# EAGLE design lotokey (EAGLE 9.6.2)
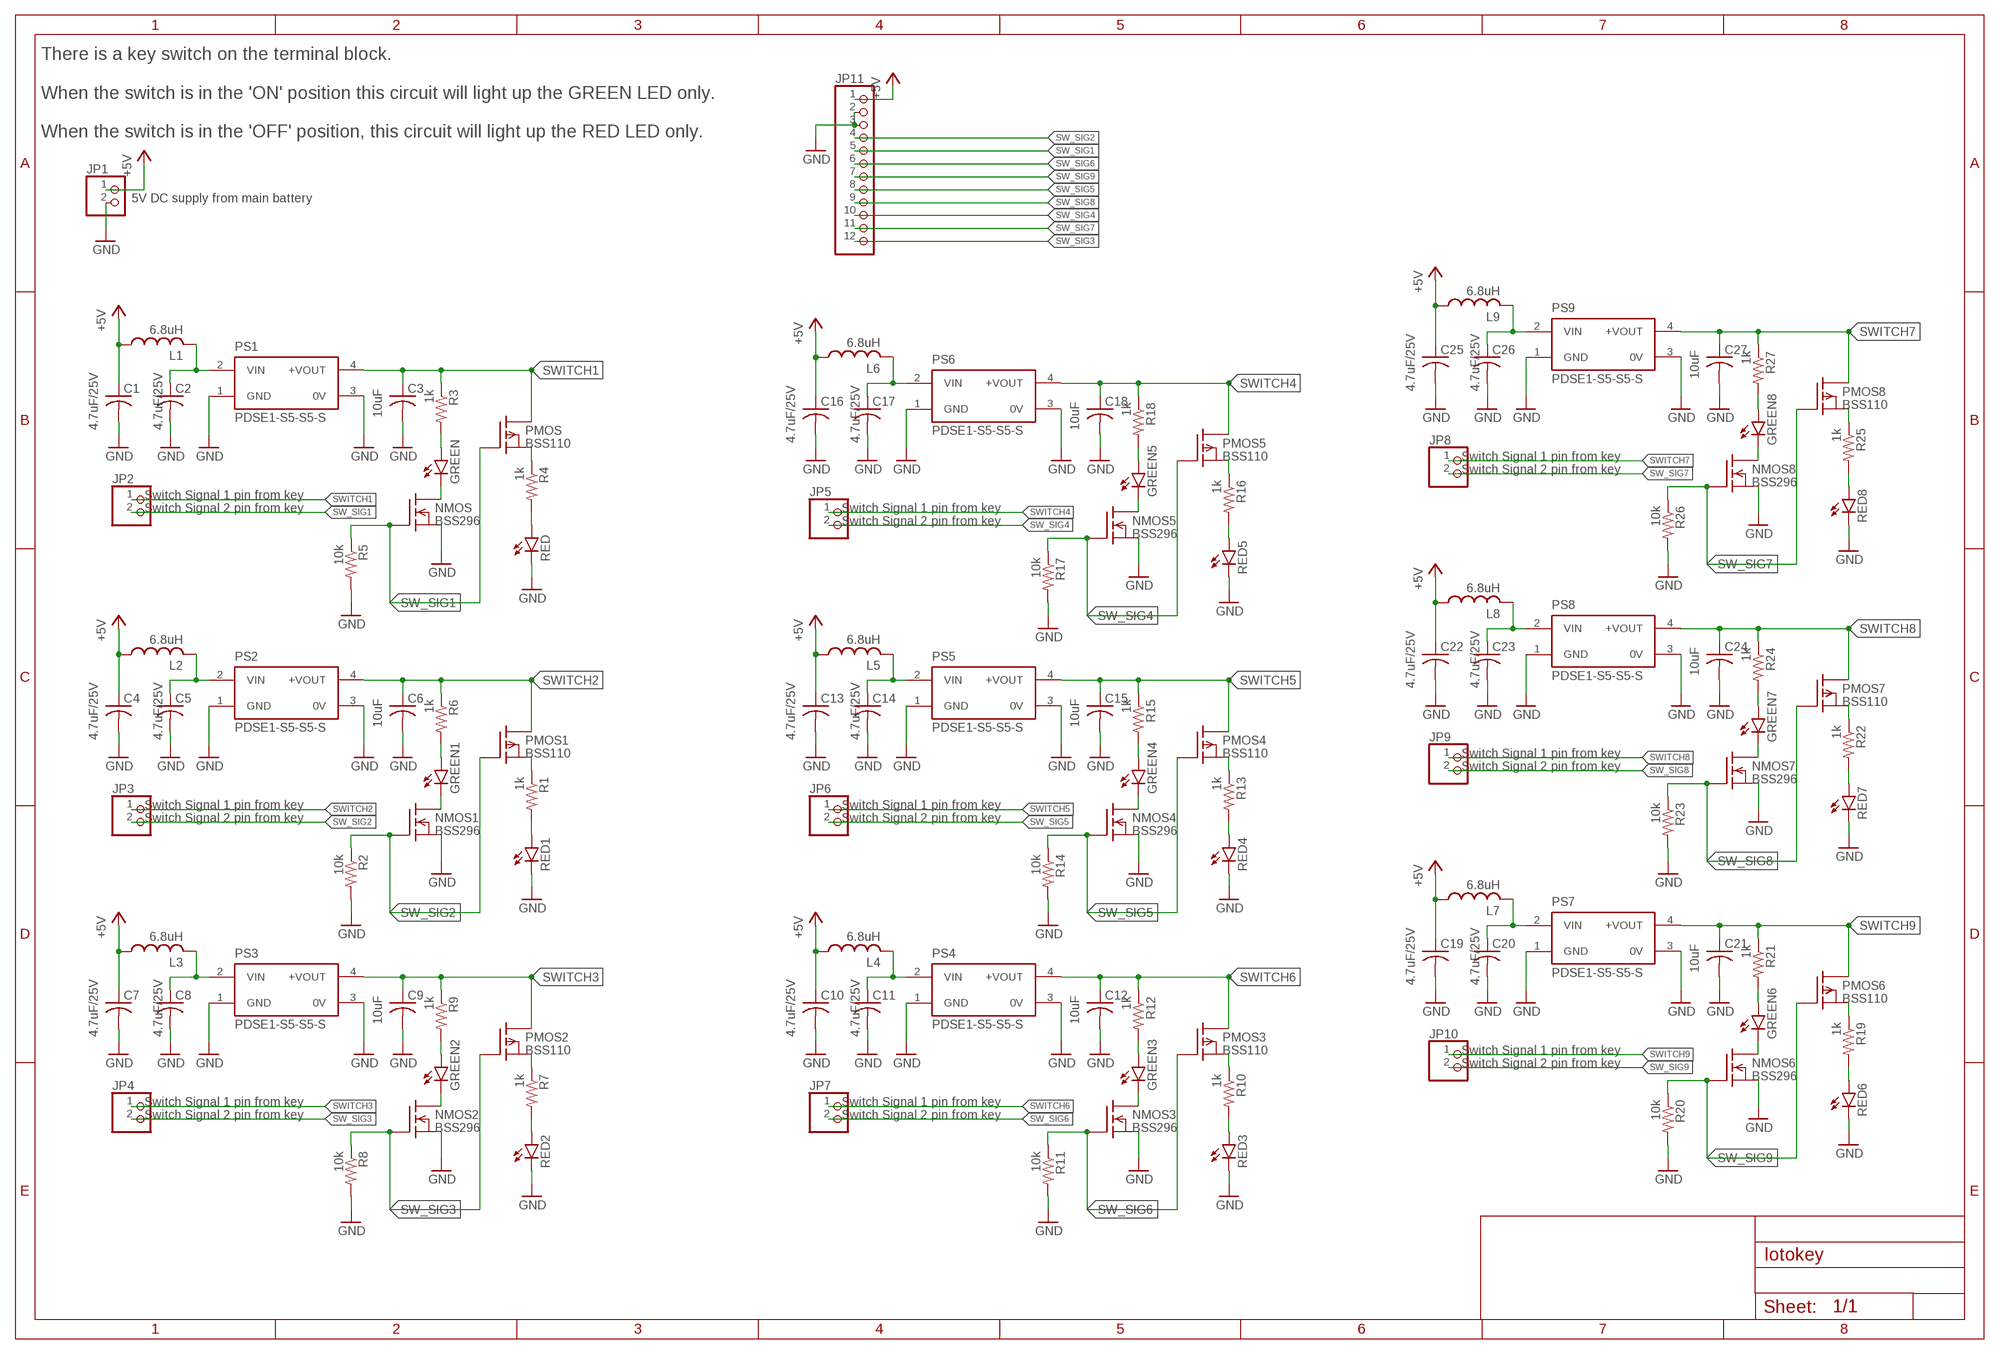
[diagram p0: schematic, sheet 1]

## Parts
C1  4.7uF/25V  C-US050-025X075  [C050-025X075]
C2  4.7uF/25V  C-US050-025X075  [C050-025X075]
C3  10uF  C-US050-025X075  [C050-025X075]
C4  4.7uF/25V  C-US050-025X075  [C050-025X075]
C5  4.7uF/25V  C-US050-025X075  [C050-025X075]
C6  10uF  C-US050-025X075  [C050-025X075]
C7  4.7uF/25V  C-US050-025X075  [C050-025X075]
C8  4.7uF/25V  C-US050-025X075  [C050-025X075]
C9  10uF  C-US050-025X075  [C050-025X075]
C10  4.7uF/25V  C-US050-025X075  [C050-025X075]
C11  4.7uF/25V  C-US050-025X075  [C050-025X075]
C12  10uF  C-US050-025X075  [C050-025X075]
C13  4.7uF/25V  C-US050-025X075  [C050-025X075]
C14  4.7uF/25V  C-US050-025X075  [C050-025X075]
C15  10uF  C-US050-025X075  [C050-025X075]
C16  4.7uF/25V  C-US050-025X075  [C050-025X075]
C17  4.7uF/25V  C-US050-025X075  [C050-025X075]
C18  10uF  C-US050-025X075  [C050-025X075]
C19  4.7uF/25V  C-US050-025X075  [C050-025X075]
C20  4.7uF/25V  C-US050-025X075  [C050-025X075]
C21  10uF  C-US050-025X075  [C050-025X075]
C22  4.7uF/25V  C-US050-025X075  [C050-025X075]
C23  4.7uF/25V  C-US050-025X075  [C050-025X075]
C24  10uF  C-US050-025X075  [C050-025X075]
C25  4.7uF/25V  C-US050-025X075  [C050-025X075]
C26  4.7uF/25V  C-US050-025X075  [C050-025X075]
C27  10uF  C-US050-025X075  [C050-025X075]
GREEN  TLLR4400  [LED3MM]
GREEN1  TLLR4400  [LED3MM]
GREEN2  TLLR4400  [LED3MM]
GREEN3  TLLR4400  [LED3MM]
GREEN4  TLLR4400  [LED3MM]
GREEN5  TLLR4400  [LED3MM]
GREEN6  TLLR4400  [LED3MM]
GREEN7  TLLR4400  [LED3MM]
GREEN8  TLLR4400  [LED3MM]
JP1  PINHD-1X2  [1X02]
JP2  PINHD-1X2  [1X02]
JP3  PINHD-1X2  [1X02]
JP4  PINHD-1X2  [1X02]
JP5  PINHD-1X2  [1X02]
JP6  PINHD-1X2  [1X02]
JP7  PINHD-1X2  [1X02]
JP8  PINHD-1X2  [1X02]
JP9  PINHD-1X2  [1X02]
JP10  PINHD-1X2  [1X02]
JP11  PINHD-1X12  [1X12]
L1  6.8uH  L-US0204/5  [0204/5]
L2  6.8uH  L-US0204/5  [0204/5]
L3  6.8uH  L-US0204/5  [0204/5]
L4  6.8uH  L-US0204/5  [0204/5]
L5  6.8uH  L-US0204/5  [0204/5]
L6  6.8uH  L-US0204/5  [0204/5]
L7  6.8uH  L-US0204/5  [0204/5]
L8  6.8uH  L-US0204/5  [0204/5]
L9  6.8uH  L-US0204/5  [0204/5]
NMOS  BSS296  [TO92]
NMOS1  BSS296  [TO92]
NMOS2  BSS296  [TO92]
NMOS3  BSS296  [TO92]
NMOS4  BSS296  [TO92]
NMOS5  BSS296  [TO92]
NMOS6  BSS296  [TO92]
NMOS7  BSS296  [TO92]
NMOS8  BSS296  [TO92]
PMOS  BSS110  [TO92]
PMOS1  BSS110  [TO92]
PMOS2  BSS110  [TO92]
PMOS3  BSS110  [TO92]
PMOS4  BSS110  [TO92]
PMOS5  BSS110  [TO92]
PMOS6  BSS110  [TO92]
PMOS7  BSS110  [TO92]
PMOS8  BSS110  [TO92]
PS1  PDSE1-S5-S5-S  [CONV_PDSE1-S5-S5-S]
PS2  PDSE1-S5-S5-S  [CONV_PDSE1-S5-S5-S]
PS3  PDSE1-S5-S5-S  [CONV_PDSE1-S5-S5-S]
PS4  PDSE1-S5-S5-S  [CONV_PDSE1-S5-S5-S]
PS5  PDSE1-S5-S5-S  [CONV_PDSE1-S5-S5-S]
PS6  PDSE1-S5-S5-S  [CONV_PDSE1-S5-S5-S]
PS7  PDSE1-S5-S5-S  [CONV_PDSE1-S5-S5-S]
PS8  PDSE1-S5-S5-S  [CONV_PDSE1-S5-S5-S]
PS9  PDSE1-S5-S5-S  [CONV_PDSE1-S5-S5-S]
R1  1k  R-US_0204/7  [0204/7]
R2  10k  R-US_0204/7  [0204/7]
R3  1k  R-US_0204/7  [0204/7]
R4  1k  R-US_0204/7  [0204/7]
R5  10k  R-US_0204/7  [0204/7]
R6  1k  R-US_0204/7  [0204/7]
R7  1k  R-US_0204/7  [0204/7]
R8  10k  R-US_0204/7  [0204/7]
R9  1k  R-US_0204/7  [0204/7]
R10  1k  R-US_0204/7  [0204/7]
R11  10k  R-US_0204/7  [0204/7]
R12  1k  R-US_0204/7  [0204/7]
R13  1k  R-US_0204/7  [0204/7]
R14  10k  R-US_0204/7  [0204/7]
R15  1k  R-US_0204/7  [0204/7]
R16  1k  R-US_0204/7  [0204/7]
R17  10k  R-US_0204/7  [0204/7]
R18  1k  R-US_0204/7  [0204/7]
R19  1k  R-US_0204/7  [0204/7]
R20  10k  R-US_0204/7  [0204/7]
R21  1k  R-US_0204/7  [0204/7]
R22  1k  R-US_0204/7  [0204/7]
R23  10k  R-US_0204/7  [0204/7]
R24  1k  R-US_0204/7  [0204/7]
R25  1k  R-US_0204/7  [0204/7]
R26  10k  R-US_0204/7  [0204/7]
R27  1k  R-US_0204/7  [0204/7]
RED  TLLR4400  [LED3MM]
RED1  TLLR4400  [LED3MM]
RED2  TLLR4400  [LED3MM]
RED3  TLLR4400  [LED3MM]
RED4  TLLR4400  [LED3MM]
RED5  TLLR4400  [LED3MM]
RED6  TLLR4400  [LED3MM]
RED7  TLLR4400  [LED3MM]
RED8  TLLR4400  [LED3MM]

## Nets
+5V: C1.1 C4.1 C7.1 C10.1 C13.1 C16.1 C19.1 C22.1 C25.1 JP1.1 JP11.1 L1.1 L2.1 L3.1 L4.1 L5.1 L6.1 L7.1 L8.1 L9.1
GND: C1.2 C2.2 C3.2 C4.2 C5.2 C6.2 C7.2 C8.2 C9.2 C10.2 C11.2 C12.2 C13.2 C14.2 C15.2 C16.2 C17.2 C18.2 C19.2 C20.2 C21.2 C22.2 C23.2 C24.2 C25.2 C26.2 C27.2 JP1.2 JP11.2 JP11.3 NMOS1.3(S) NMOS2.3(S) NMOS3.3(S) NMOS4.3(S) NMOS5.3(S) NMOS6.3(S) NMOS7.3(S) NMOS8.3(S) NMOS.3(S) PS1.1(GND) PS1.3(0V) PS2.1(GND) PS2.3(0V) PS3.1(GND) PS3.3(0V) PS4.1(GND) PS4.3(0V) PS5.1(GND) PS5.3(0V) PS6.1(GND) PS6.3(0V) PS7.1(GND) PS7.3(0V) PS8.1(GND) PS8.3(0V) PS9.1(GND) PS9.3(0V) R2.2 R5.2 R8.2 R11.2 R14.2 R17.2 R20.2 R23.2 R26.2 RED1.K(C) RED2.K(C) RED3.K(C) RED4.K(C) RED5.K(C) RED6.K(C) RED7.K(C) RED8.K(C) RED.K(C)
N$1: C2.1 L1.2 PS1.2(VIN)
N$2: R1.2 RED1.A
N$3: GREEN.K(C) NMOS.2(D)
N$4: GREEN.A R3.2
N$5: PMOS1.1(S) R1.1
N$6: C5.1 L2.2 PS2.2(VIN)
N$7: GREEN1.K(C) NMOS1.2(D)
N$8: R4.2 RED.A
N$9: PMOS.1(S) R4.1
N$10: GREEN1.A R6.2
N$11: R7.2 RED2.A
N$12: PMOS2.1(S) R7.1
N$13: C8.1 L3.2 PS3.2(VIN)
N$14: GREEN2.K(C) NMOS2.2(D)
N$15: GREEN2.A R9.2
N$16: R10.2 RED3.A
N$17: PMOS3.1(S) R10.1
N$18: C11.1 L4.2 PS4.2(VIN)
N$19: GREEN3.K(C) NMOS3.2(D)
N$20: GREEN3.A R12.2
N$21: R13.2 RED4.A
N$22: PMOS4.1(S) R13.1
N$23: C14.1 L5.2 PS5.2(VIN)
N$24: GREEN4.K(C) NMOS4.2(D)
N$25: GREEN4.A R15.2
N$26: R16.2 RED5.A
N$27: PMOS5.1(S) R16.1
N$28: C17.1 L6.2 PS6.2(VIN)
N$29: GREEN5.K(C) NMOS5.2(D)
N$30: GREEN5.A R18.2
N$31: R19.2 RED6.A
N$32: PMOS6.1(S) R19.1
N$33: C20.1 L7.2 PS7.2(VIN)
N$34: GREEN6.K(C) NMOS6.2(D)
N$35: GREEN6.A R21.2
N$36: R22.2 RED7.A
N$37: PMOS7.1(S) R22.1
N$38: C23.1 L8.2 PS8.2(VIN)
N$39: GREEN7.K(C) NMOS7.2(D)
N$40: GREEN7.A R24.2
N$41: R25.2 RED8.A
N$42: PMOS8.1(S) R25.1
N$43: C26.1 L9.2 PS9.2(VIN)
N$44: GREEN8.K(C) NMOS8.2(D)
N$45: GREEN8.A R27.2
SW_SIG1: JP2.2 JP11.5 NMOS.1(G) PMOS.2(G) R5.1
SW_SIG2: JP3.2 JP11.4 NMOS1.1(G) PMOS1.2(G) R2.1
SW_SIG3: JP4.2 JP11.12 NMOS2.1(G) PMOS2.2(G) R8.1
SW_SIG4: JP5.2 JP11.10 NMOS5.1(G) PMOS5.2(G) R17.1
SW_SIG5: JP6.2 JP11.8 NMOS4.1(G) PMOS4.2(G) R14.1
SW_SIG6: JP7.2 JP11.6 NMOS3.1(G) PMOS3.2(G) R11.1
SW_SIG7: JP8.2 JP11.11 NMOS8.1(G) PMOS8.2(G) R26.1
SW_SIG8: JP9.2 JP11.9 NMOS7.1(G) PMOS7.2(G) R23.1
SW_SIG9: JP10.2 JP11.7 NMOS6.1(G) PMOS6.2(G) R20.1
SWITCH1: C3.1 JP2.1 PMOS.3(D) PS1.4(+VOUT) R3.1
SWITCH2: C6.1 JP3.1 PMOS1.3(D) PS2.4(+VOUT) R6.1
SWITCH3: C9.1 JP4.1 PMOS2.3(D) PS3.4(+VOUT) R9.1
SWITCH4: C18.1 JP5.1 PMOS5.3(D) PS6.4(+VOUT) R18.1
SWITCH5: C15.1 JP6.1 PMOS4.3(D) PS5.4(+VOUT) R15.1
SWITCH6: C12.1 JP7.1 PMOS3.3(D) PS4.4(+VOUT) R12.1
SWITCH7: C27.1 JP8.1 PMOS8.3(D) PS9.4(+VOUT) R27.1
SWITCH8: C24.1 JP9.1 PMOS7.3(D) PS8.4(+VOUT) R24.1
SWITCH9: C21.1 JP10.1 PMOS6.3(D) PS7.4(+VOUT) R21.1

## Notes on the sheet
- There is a key switch on the terminal block. 
  
  When the switch is in the 'ON' position this circuit will light up the GREEN LED only. 
  
  When the switch is in the 'OFF' position, this circuit will light up the RED LED only.
- 5V DC supply from main battery
- Switch Signal 1 pin from key
- Switch Signal 2 pin from key
- Switch Signal 1 pin from key
- Switch Signal 2 pin from key | Switch Signal 1 pin from key
- Switch Signal 2 pin from key
- Switch Signal 1 pin from key
- Switch Signal 2 pin from key
- Switch Signal 1 pin from key | Switch Signal 1 pin from key
- Switch Signal 2 pin from key | Switch Signal 2 pin from key
- Switch Signal 1 pin from key
- Switch Signal 2 pin from key
- Switch Signal 1 pin from key | Switch Signal 1 pin from key
- Switch Signal 2 pin from key | Switch Signal 2 pin from key

## Library data of the parts
C1 C2 C4 C5 C7 C8 C10 C11 C13 C14 C16 C17 C19 C20 C22 C23 C25 C26 = rcl:C-US: CAPACITOR, American symbol; DIS: Digi-Key; DPN: 445-173577-1-ND; MFR: TDK Corporation; MPN: FG28X5R1E475KRT06; SPICEPREFIX: C
C3 C6 C9 C12 C15 C18 C21 C24 C27 = rcl:C-US: CAPACITOR, American symbol; DIS: Digi-Key; DPN: 445-181284-1-ND; MFR: TDK Corporation; MPN: FG28X5R1E106MRT06; SPICEPREFIX: C
GREEN GREEN1-GREEN8 = led:TLLR4400: Low Current (2mA) LED 3 mm Tinted Diffused Package color RED Source: Data sheet <http://www.farnell.com/datasheets/391100.pdf>; DIS: Digi-Key; DPN: TLHG5200-ND; MF: VISHAY SEMICONDUCTOR; MFR: Vishay Semiconductor Opto Division; MPN: TLHG5200; OC_FARNELL: 1612437
JP1-JP10 = pinhead:PINHD-1X2: PIN HEADER; DIS: Digi-Key; DPN: ED10561-ND; MFR: On Shore Technology Inc.; MPN: OSTVN02A150
JP11 = pinhead:PINHD-1X12: PIN HEADER; DIS: Digi-Key; DPN: A19439-ND; MFR: TE Connectivity AMP Connectors; MPN: 1-640454-2
L1-L9 = rcl:L-US: INDUCTOR, American symbol; DIS: Digi-Key; DPN: 495-5572-1-ND; MFR: EPCOS - TDK Electronics; MPN: B78108S1682K000; SPICEPREFIX: L
NMOS NMOS1-NMOS8 = transistor-fet:BSS296: N-Channel Enhancement MOSFET not checked; DIS: Digi-Key; DPN: 2N7000-G-ND; MFR: Microchip Technology; MPN: 2N7000-G
PMOS PMOS1-PMOS8 = transistor-fet:BSS110: P-Channel Enhancement MOSFET -50V; -0,17A; 6Ohm; DIS: Digi-Key; DPN: TP2104N3-G-ND; MFR: Microchip Technology; MPN: TP2104N3-G
PS1-PS9 = PDSE1-S5-S5-S:PDSE1-S5-S5-S: DC-DC CONVERTER; CUI_PURCHASE_URL: https://www.cui.com/product/dc-dc-converters/isolated/pdse1-s-series?utm_source=snapeda.com&utm_medium=referral&utm_campaign=snapedaBOM; DESCRIPTION: 1 W, 1:1 Input Range, Single Unregulated Output, SIP, 1500 Vdc Isolation, Dc-Dc Converter; DIGI-KEY_PART_NUMBER: 102-6291-ND; DIS: Digi-Key; DPN: 102-6291-ND; MF: CUI Inc.; MFR: CUI Inc.; MP: PDSE1-S5-S5-S; MPN: PDSE1-S5-S5-S; PACKAGE: SIP-4 CUI Inc.; PURCHASE-URL: https://pricing.snapeda.com/search/part/PDSE1-S5-S5-S/?ref=eda
R1 R3 R4 R6 R7 R9 R10 R12 R13 R15 R16 R18 R19 R21 R22 R24 R25 R27 = rcl:R-US_: RESISTOR, American symbol; DIS: Digi-Key; DPN: 749-2068-1-ND; MFR: Vishay Beyschlag/Draloric/BC Components; MPN: CCF551K00FKE36; SPICEPREFIX: R
R2 R5 R8 R11 R14 R17 R20 R23 R26 = rcl:R-US_: RESISTOR, American symbol; DIS: Digi-Key; DPN: 749-2062-1-ND; MFR: Vishay Beyschlag/Draloric/BC Components; MPN: CCF5510K0FKE36; SPICEPREFIX: R
RED RED1-RED8 = led:TLLR4400: Low Current (2mA) LED 3 mm Tinted Diffused Package color RED Source: Data sheet <http://www.farnell.com/datasheets/391100.pdf>; DIS: Digi-Key; DPN: TLUR6400-ND; MF: VISHAY SEMICONDUCTOR; MFR: Vishay Semiconductor Opto Division; MPN: TLUR6400; OC_FARNELL: 1612437

## Board
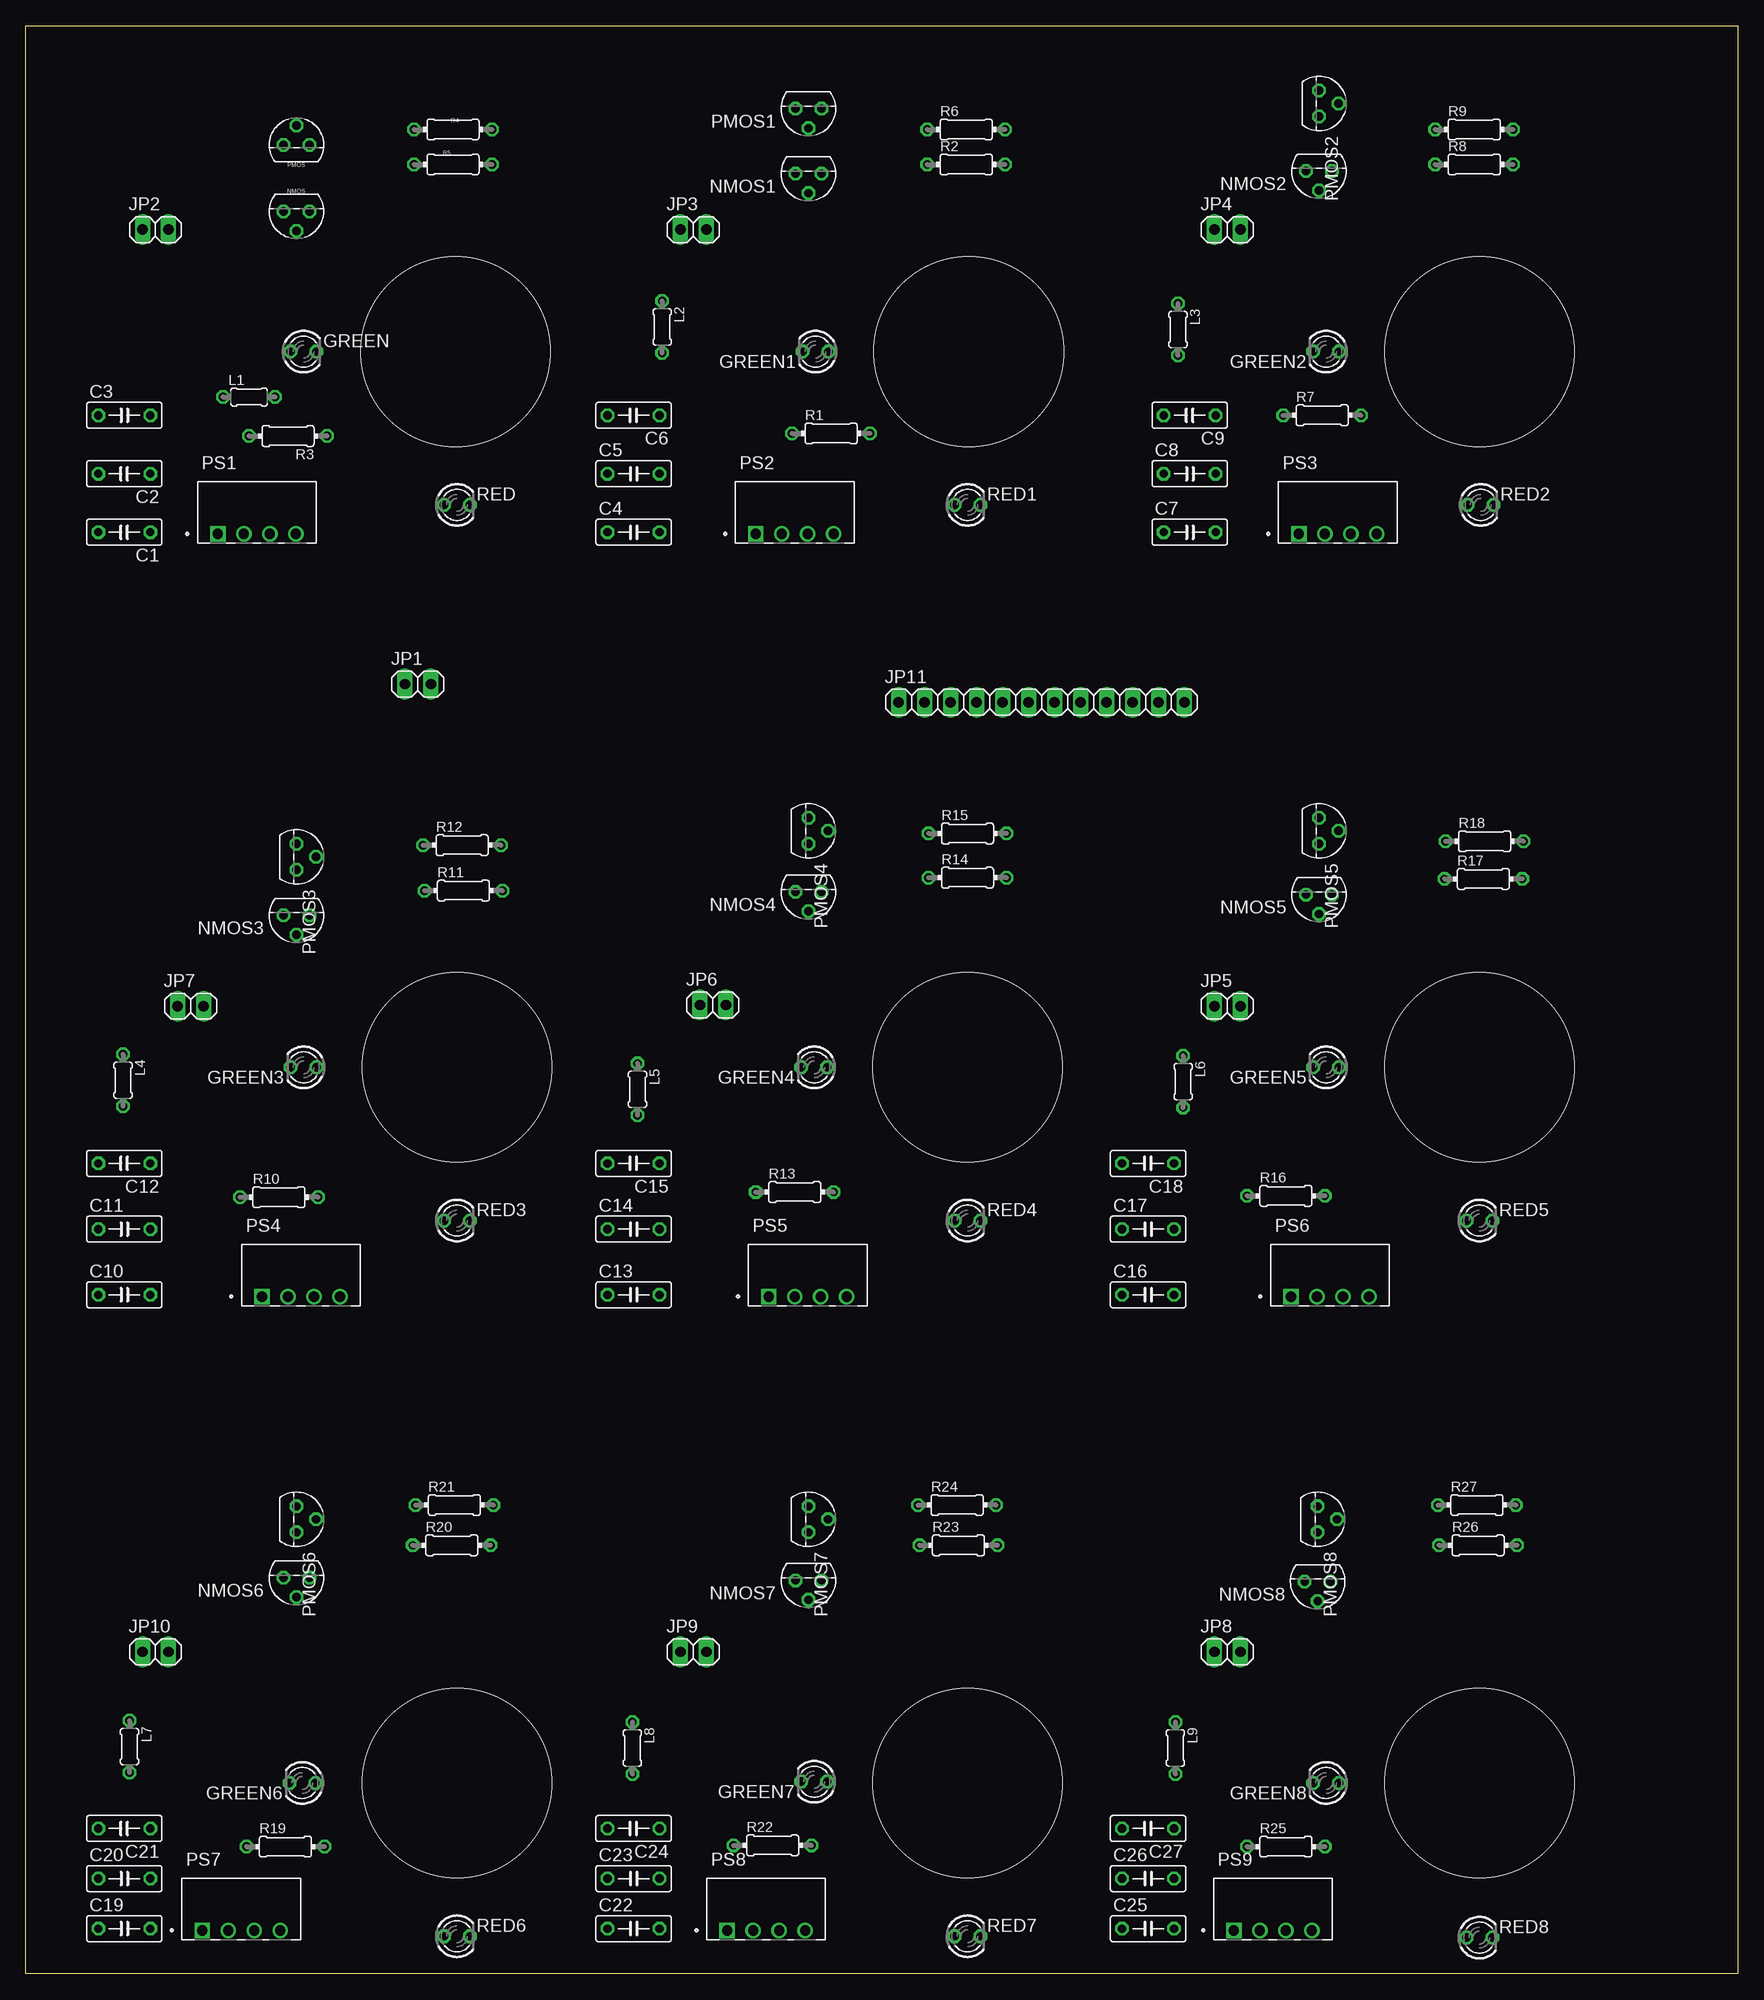
[diagram p1: board, top side]
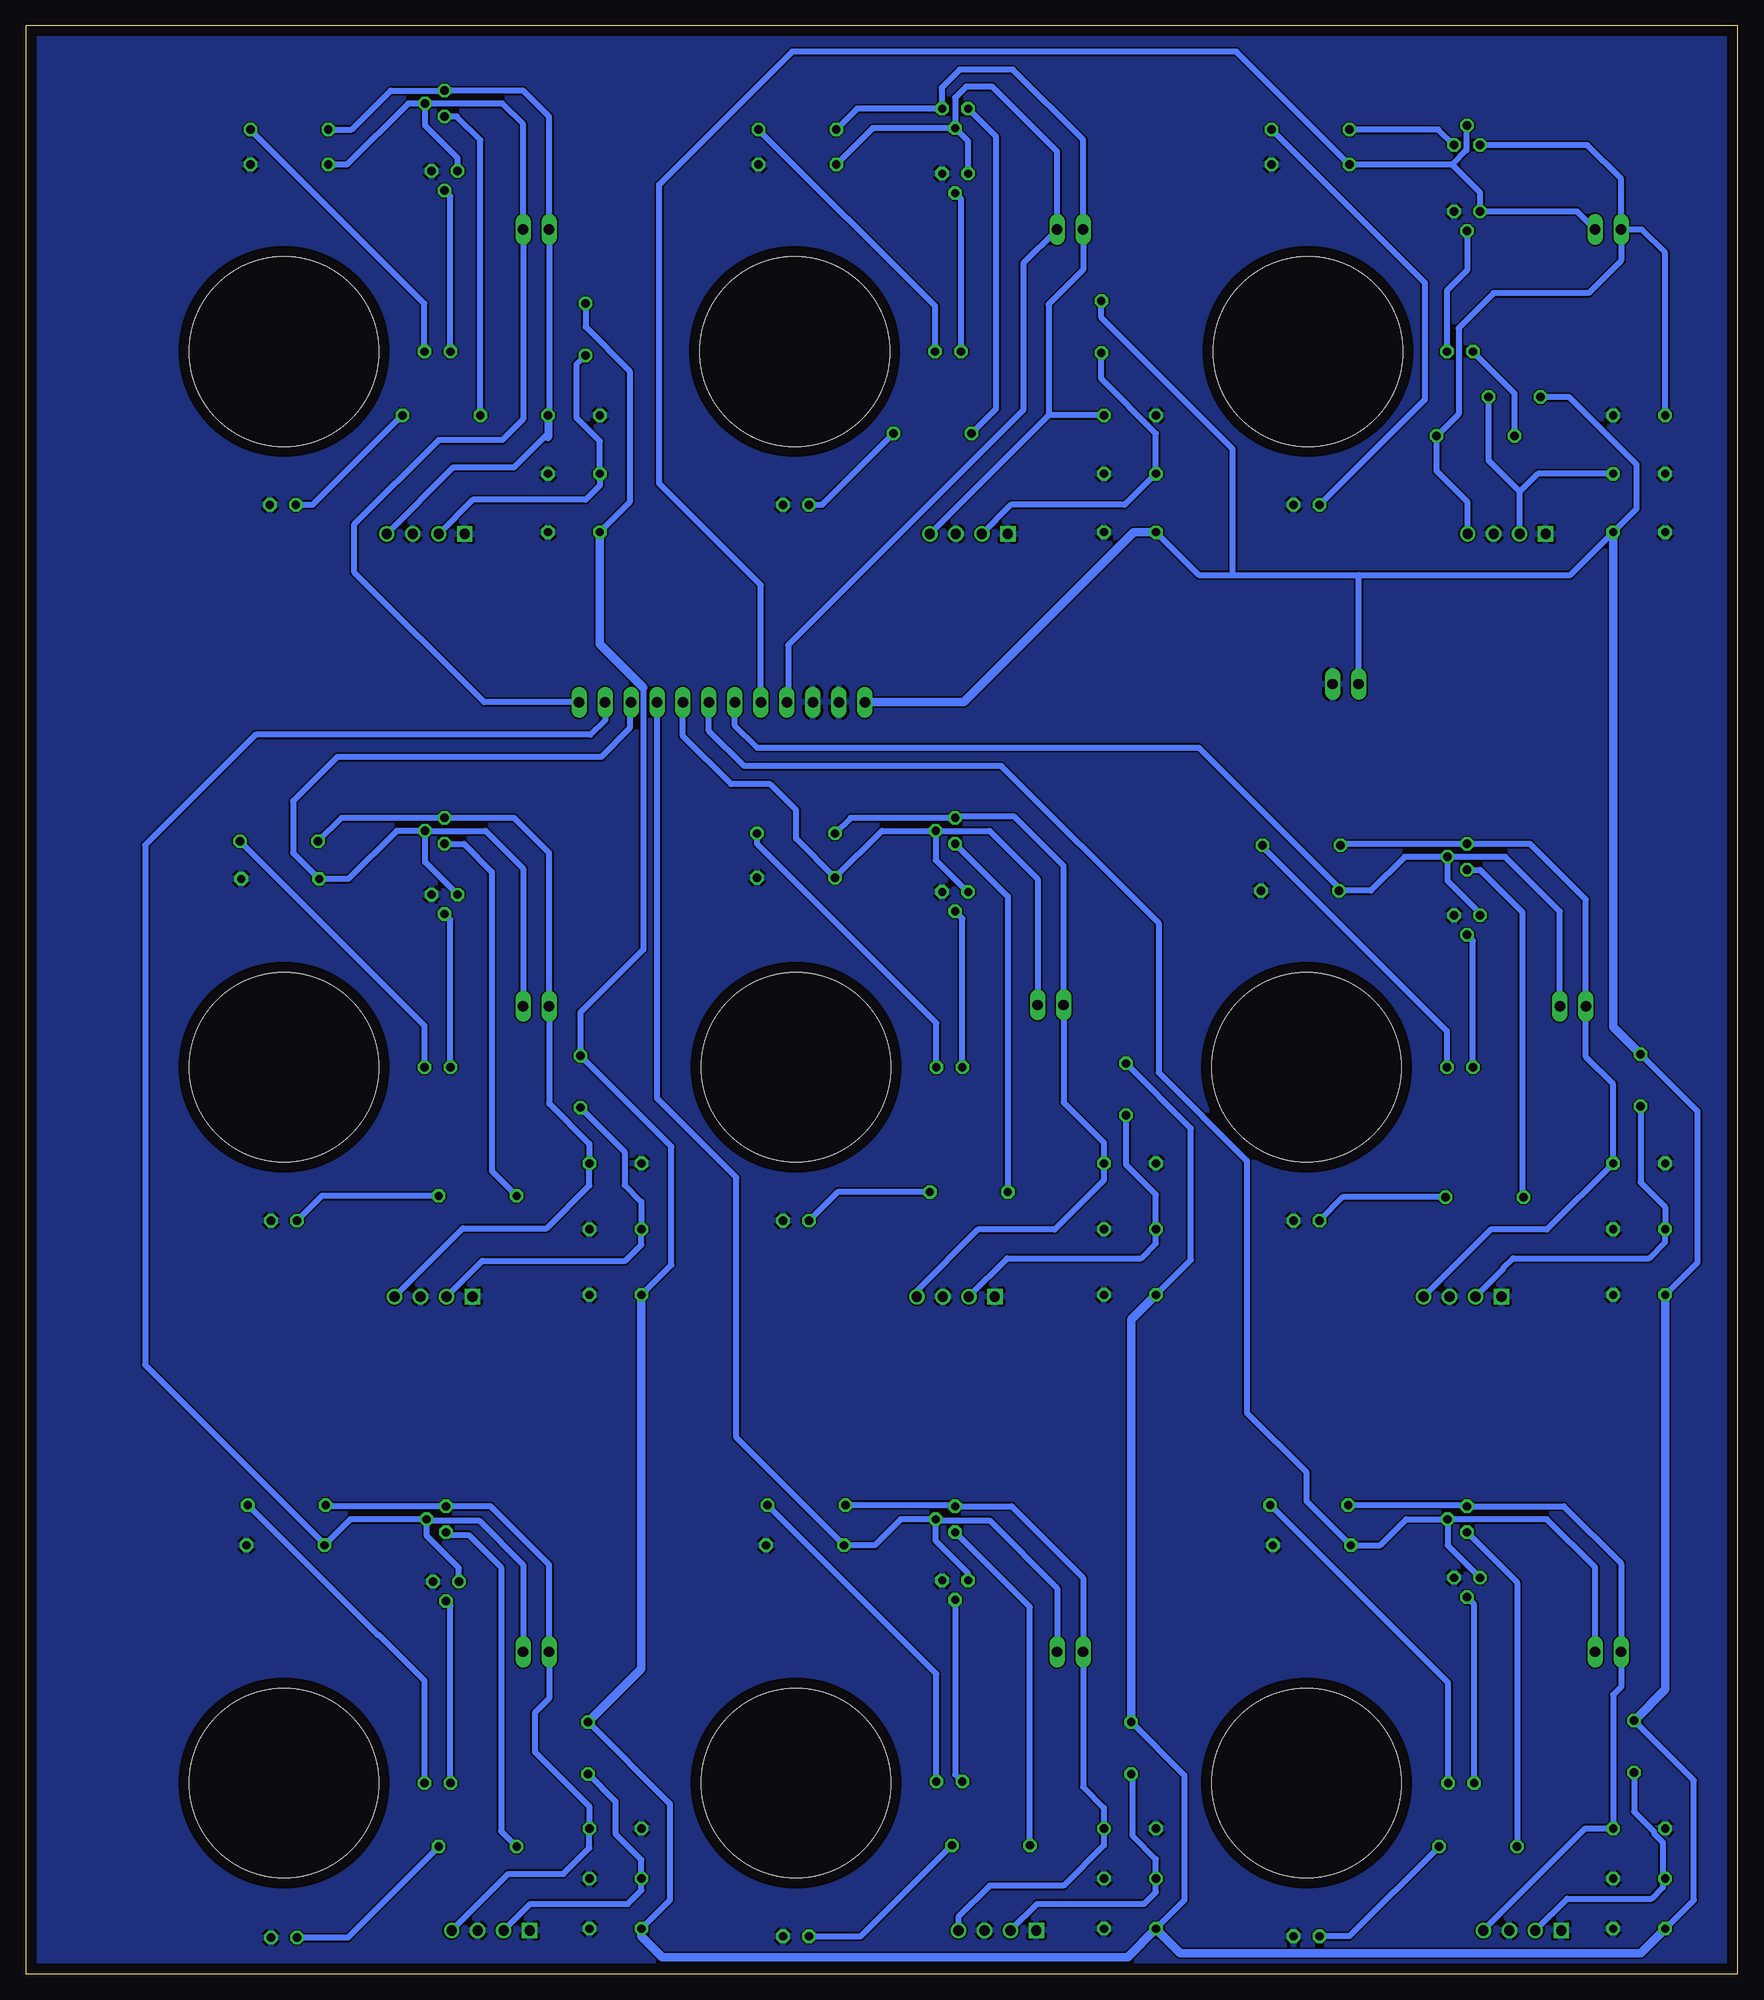
[diagram p2: board, bottom side, seen from below]

Size 167.39 x 190.5 mm. Coordinates in mm from the lower left corner, seen from the top.
Outline: 167.39,0 0,0 0,190.5 167.39,190.5 167.39,0
Copper layers (1*16): Top 0.035mm / dielectric 1.5mm / Bottom 0.035mm
Design rules "default": minimum track width 6mil, minimum drill 0.35mm, track to track 6mil, track to pad 6mil, pad to pad 6mil, via to via 6mil, smd to smd 6mil, copper to edge 40mil, drill to drill 6mil, minimum pad ring 10mil, minimum via ring 8mil, stop-mask expansion 4mil, vias tented up to drill 0mil, thermal gap 10mil
Holes 18.54 mm at 42.04,158.62 92.2,158.62 142.11,158.62 142.11,88.65 92.07,88.65 42.16,88.65 42.16,18.67 92.07,18.67 142.11,18.67

### Footprints (pad centres in the part's own frame; a part is rotated, then mirrored left to right if it is on the bottom)
C050-025X075 = drill 0.813 octagon: 1 -2.54,0; 2 2.54,0
LED3MM = drill 0.813 octagon: A -1.27,0; K 1.27,0
1X02 = drill 1.016 long: 1 -1.27,0; 2 1.27,0
1X12 = drill 1.016 long: 1 -13.97,0; 2 -11.43,0; 3 -8.89,0; 4 -6.35,0; 5 -3.81,0; 6 -1.27,0; 7 1.27,0; 8 3.81,0; 9 6.35,0; 10 8.89,0; 11 11.43,0; 12 13.97,0
0204/5 = drill 0.813 octagon: 1 -2.54,0; 2 2.54,0
TO92 = drill 0.813 octagon: 1 1.27,0; 2 0,1.905; 3 -1.27,0
CONV_PDSE1-S5-S5-S = drill 1 square: 1 -3.81,-2.1 | drill 1: 2 -1.27,-2.1; 3 1.27,-2.1; 4 3.81,-2.1
0204/7 = drill 0.813 octagon: 1 -3.81,0; 2 3.81,0

### Placement (x,y rotation side)
C1  9.65,140.97 180 top
C2  9.65,146.69 180 top
C3  9.65,152.4 0 top
C4  59.44,140.97 0 top
C5  59.44,146.69 0 top
C6  59.44,152.4 180 top
C7  113.79,140.97 0 top
C8  113.79,146.69 0 top
C9  113.79,152.4 180 top
C10  9.65,66.4 0 top
C11  9.65,72.82 0 top
C12  9.65,79.25 180 top
C13  59.44,66.4 0 top
C14  59.44,72.82 0 top
C15  59.44,79.25 180 top
C16  109.73,66.4 0 top
C17  109.73,72.82 0 top
C18  109.73,79.25 180 top
C19  9.65,4.42 0 top
C20  9.65,9.32 0 top
C21  9.65,14.22 180 top
C22  59.44,4.42 0 top
C23  59.44,9.32 0 top
C24  59.44,14.22 180 top
C25  109.73,4.42 0 top
C26  109.73,9.32 0 top
C27  109.73,14.22 180 top
GREEN  27.18,158.62 0 top
GREEN1  77.22,158.62 180 top
GREEN2  127.13,158.62 180 top
GREEN3  27.18,88.65 180 top
GREEN4  77.09,88.65 180 top
GREEN5  127.13,88.65 180 top
GREEN6  27.05,18.67 180 top
GREEN7  77.09,18.8 180 top
GREEN8  127.13,18.67 180 top
JP1  38.35,126.11 0 top
JP2  12.7,170.56 0 top
JP3  65.28,170.56 0 top
JP4  117.47,170.56 0 top
JP5  117.47,94.61 0 top
JP6  67.18,94.74 0 top
JP7  16.13,94.61 0 top
JP8  117.47,31.5 0 top
JP9  65.28,31.5 0 top
JP10  12.7,31.5 0 top
JP11  99.31,124.33 0 top
L1  21.84,154.18 0 top
L2  62.23,161.04 270 top
L3  112.65,160.78 270 top
L4  9.53,87.38 270 top
L5  59.82,86.49 270 top
L6  113.16,87.25 270 top
L7  10.16,22.22 270 top
L8  59.31,22.1 270 top
L9  112.39,22.1 270 top
NMOS  26.48,172.34 180 top
NMOS1  76.52,176.02 180 top
NMOS2  126.43,176.28 180 top
NMOS3  26.48,103.5 180 top
NMOS4  76.52,105.79 180 top
NMOS5  126.43,105.54 180 top
NMOS6  26.48,38.73 180 top
NMOS7  76.52,38.48 180 top
NMOS8  126.3,38.35 180 top
PMOS  26.48,178.82 0 top
PMOS1  76.52,182.37 180 top
PMOS2  126.43,182.88 270 top
PMOS3  26.48,109.22 270 top
PMOS4  76.52,111.76 270 top
PMOS5  126.43,111.76 270 top
PMOS6  26.48,44.45 270 top
PMOS7  76.52,44.45 270 top
PMOS8  126.3,44.45 270 top
PS1  22.61,142.9 0 top
PS2  75.18,142.9 0 top
PS3  128.27,142.9 0 top
PS4  26.92,68.33 0 top
PS5  76.45,68.33 0 top
PS6  127.51,68.33 0 top
PS7  21.08,6.35 0 top
PS8  72.39,6.35 0 top
PS9  121.92,6.35 0 top
R1  78.74,150.62 0 top
R2  91.95,176.91 0 top
R3  25.65,150.37 180 top
R4  41.78,180.34 0 top
R5  41.78,176.91 0 top
R6  91.95,180.34 0 top
R7  126.75,152.4 0 top
R8  141.61,176.91 0 top
R9  141.61,180.34 0 top
R10  24.77,75.95 0 top
R11  42.8,105.92 0 top
R12  42.67,110.36 0 top
R13  75.18,76.45 0 top
R14  92.07,107.19 0 top
R15  92.07,111.51 0 top
R16  123.19,76.07 0 top
R17  142.49,107.06 0 top
R18  142.62,110.74 0 top
R19  25.4,12.45 0 top
R20  41.66,41.91 0 top
R21  41.91,45.85 0 top
R22  73.02,12.57 0 top
R23  91.19,41.91 0 top
R24  91.06,45.85 0 top
R25  123.19,12.45 0 top
R26  141.99,41.91 0 top
R27  141.86,45.85 0 top
RED  42.16,143.64 0 top
RED1  92.07,143.64 0 top
RED2  142.24,143.64 0 top
RED3  42.16,73.66 0 top
RED4  92.07,73.66 0 top
RED5  142.11,73.66 0 top
RED6  42.16,3.68 0 top
RED7  92.07,3.68 0 top
RED8  142.11,3.56 0 top

### Tracks (layer width: path | path; a pad name or v marks a point on that pad's centre or on a via)
+5V
  Bottom 0.61: L1.1 16.51,154.18 9.91,147.57 9.91,143.26 C1.1 16.38,136.78 37.08,136.78 | C4.1 52.71,136.78 49.4,136.78 | 49.4,136.78 37.08,136.78 | 49.4,136.78 49.4,149.1 62.23,161.93 L2.1 | L3.1 112.65,161.04 108.33,156.72 108.33,143.89 C7.1 | C16.1 104.27,69.32 104.27,80.9 L6.1 113.16,93.98 106.98,100.15 106.98,125.78 | C13.1 53.47,69.83 53.47,82.68 L5.1 | C10.1 3.94,69.57 3.94,84.33 L4.1 | C25.1 104.39,7.21 104.39,16.64 L9.1 | L8.1 54.1,19.43 54.1,7.21 C22.1 | C19.1 4.32,7.21 4.32,18.92 L7.1 | JP1.1 37.08,136.78
  Bottom 0.813: JP11.1 75.69,124.33 59.05,140.97 C4.1 | C1.1 12.19,92.58 L4.1 | C10.1 7.11,27.81 L7.1 | C19.1 9.5,2.03 54.51,2.03 C22.1 59.67,1.65 105.16,1.65 107.19,3.68 C25.1 | L8.1 59.31,63.98 C13.1 | L9.1 107.19,29.84 C16.1 | C7.1 111.25,130.05 106.98,125.78
GND
  pour Bottom: 0.13,190.37 167.39,190.37 167.39,-0.25 0.13,-0.25
N$1
  Bottom 0.61: PS1.2 21.34,144.91 | L1.2 24.38,147.96 21.34,144.91 | C2.1 19.56,146.69 21.34,144.91
N$2
  Bottom 0.61: RED1.A 89.53,143.64 R1.2
N$3
  Bottom 0.61: NMOS.2 26.48,166.56 28.45,164.59 GREEN.K
N$4
  Bottom 0.61: GREEN.A 21.84,154.56 R3.2
N$5
  Bottom 0.61: R1.1 72.52,153.03 72.52,179.64 PMOS1.1
N$6
  Bottom 0.61: PS2.2 71.08,143.64 59.94,143.64 C5.1 56.9,150.62 62.23,155.96 L2.2
N$7
  Bottom 0.61: GREEN1.K 75.95,173.55 NMOS1.2
N$8
  Bottom 0.61: R4.2 30.61,165.35 30.61,153.92 RED.A
N$9
  Bottom 0.61: PMOS.1 29.27,180.34 R4.1
N$10
  Bottom 0.61: GREEN1.A 78.49,163.07 R6.2
N$11
  Bottom 0.61: RED2.A 139.32,143.64 R7.2
N$12
  Bottom 0.61: R7.1 122.94,179.32 125.22,181.61 PMOS2.1
N$13
  Bottom 0.61: L3.2 113.54,157.35 113.54,152.15 111.25,149.86 C8.1 111.25,145.54 112.65,144.15 123.65,144.15 PS3.2
N$14
  Bottom 0.61: GREEN2.K 125.86,173.8 NMOS2.2
N$15
  Bottom 0.61: GREEN2.A 128.4,163.32 R9.2
N$16
  Bottom 0.61: R10.2 38.61,75.95 RED3.A
N$17
  Bottom 0.61: PMOS3.1 25.21,107.95 21.08,103.82 21.08,76.07 R10.1
N$18
  Bottom 0.61: L4.2 9.53,77.39 7.11,74.98 C11.1 7.11,71.55 8.69,69.98 21.97,69.98 22.99,68.96 22.99,68.89 PS4.2
N$19
  Bottom 0.61: GREEN3.K 25.91,101.03 NMOS3.2
N$20
  Bottom 0.61: R12.2 46.48,110.24 28.45,92.2 GREEN3.A
N$21
  Bottom 0.61: R13.2 88.01,76.45 RED4.A
N$22
  Bottom 0.61: PMOS4.1 71.37,105.35 R13.1
N$23
  Bottom 0.61: PS5.2 71.43,69.98 58.35,69.98 56.9,71.43 C14.1 56.9,76.2 59.82,79.12 L5.2
N$24
  Bottom 0.61: GREEN4.K 75.82,103.19 NMOS4.2
N$25
  Bottom 0.61: GREEN4.A 78.36,92.96 95.88,110.49 R15.2
N$26
  Bottom 0.61: R16.2 138.43,76.07 RED5.A
N$27
  Bottom 0.61: PMOS5.1 124.52,110.49 121.79,107.76 121.79,78.49 R16.1
N$28
  Bottom 0.61: PS6.2 122.74,69.72 108.76,69.72 107.19,71.3 C17.1 107.19,75.49 108.84,77.14 108.84,80.39 L6.2
N$29
  Bottom 0.61: GREEN5.K 125.86,103.06 NMOS5.2
N$30
  Bottom 0.61: R18.2 128.4,92.71 GREEN5.A
N$31
  Bottom 0.61: R19.2 37.97,3.68 RED6.A
N$32
  Bottom 0.61: PMOS6.1 21.59,38.29 R19.1
N$33
  Bottom 0.61: PS7.2 16.7,7.37 8.43,7.37 7.33,8.47 7.33,9.11 | 7.33,9.11 C20.1 | L7.2 10.16,15.88 8.23,13.95 8.23,13.76 7.33,12.86 7.33,9.11
N$34
  Bottom 0.61: GREEN6.K 25.78,36.13 NMOS6.2
N$35
  Bottom 0.61: GREEN6.A 28.32,28.45 R21.2
N$36
  Bottom 0.61: RED7.A 85.72,3.68 R22.2
N$37
  Bottom 0.61: R22.1 69.21,35.88 PMOS7.1
N$38
  Bottom 0.61: PS8.2 68.51,6.86 58.04,6.86 56.9,8 C23.1 56.9,11.23 59.18,13.51 59.18,19.43 L8.2
N$39
  Bottom 0.61: NMOS7.2 76.52,19.49 GREEN7.K
N$40
  Bottom 0.61: GREEN7.A 78.36,29.34 R24.2
N$41
  Bottom 0.61: R25.2 135.89,3.56 RED8.A
N$42
  Bottom 0.61: PMOS8.1 126.05,42.93 124.08,42.93 120.9,39.75 120.9,13.97 R25.1
N$43
  Bottom 0.61: PS9.2 118.04,6.86 108.51,6.86 107.19,8.18 C26.1 107.19,11.18 109.73,13.72 109.73,16.89 L9.2
N$44
  Bottom 0.61: GREEN8.K 125.86,36.01 NMOS8.2
N$45
  Bottom 0.61: R27.2 132.97,33.15 132.84,33.15 128.4,28.7 GREEN8.A
SW_SIG1
  Bottom 0.61: JP2.2 15.75,172.34 NMOS.1 25.21,174.18 27.94,176.91 | PMOS.2 26.54,180.66 26.54,178.31 27.94,176.91 | 27.94,176.91 R5.1 49.02,187.96 92.46,187.96 105.46,174.96 105.46,145.73 95.5,135.77 JP11.5
SW_SIG2
  Bottom 0.61: PMOS1.2 75.25,179.2 NMOS1.1 | PMOS1.2 76.52,183.45 75.44,184.53 72.9,184.53 66.55,178.18 JP3.2 69.85,167.26 69.85,152.91 92.84,129.92 92.84,124.46 JP11.4 | PMOS1.2 84.58,180.47 R2.1 88.52,176.91
SW_SIG3
  Bottom 0.61: NMOS2.1 125.16,177.55 128.33,180.72 PMOS2.2 | PMOS2.2 129.98,182.88 136.01,176.91 R8.1 | PMOS2.2 120.78,182.88 118.74,180.85 JP4.2 118.74,152.02 120.78,149.99 127,149.99 135.25,141.73 135.25,137.03 122.55,124.33 JP11.12
SW_SIG4
  Bottom 0.61: PMOS5.2 122.43,111.76 118.74,108.08 JP5.2 | PMOS5.2 131.13,111.76 135.83,107.06 R17.1 141.22,109.6 141.22,114.68 136.91,119 111.12,119 108.33,121.79 108.33,124.21 JP11.10 | NMOS5.1 128.33,108.71 PMOS5.2
SW_SIG5
  Bottom 0.61: PMOS4.2 73.15,111.76 68.45,107.06 JP6.2 | PMOS4.2 83.69,111.76 R14.1 92.07,111 92.07,113.79 94.61,116.33 98.42,116.33 103.12,121.03 JP11.8 | PMOS4.2 78.42,108.9 75.31,105.79 NMOS4.1
SW_SIG6
  Bottom 0.61: NMOS3.1 25.21,103.69 28.38,106.87 PMOS3.2 | PMOS3.2 32.58,109.22 35.88,105.92 R11.1 38.99,106.17 52.71,119.89 95.88,119.89 98.04,122.05 JP11.6 | JP7.2 17.4,103.89 22.73,109.22 PMOS3.2
SW_SIG7
  Bottom 0.61: PMOS8.2 135.64,44.45 R26.1 138.18,42.04 155.7,59.56 155.7,110.36 144.91,121.16 112.14,121.16 110.74,122.55 JP11.11 | PMOS8.2 128.18,44.43 128.18,42.84 125.03,39.69 NMOS8.1 | PMOS8.2 128.08,44.32 123.06,44.32 118.74,40.01 JP8.2
SW_SIG8
  Bottom 0.61: PMOS7.2 78.3,44.32 73.15,44.32 66.55,37.72 JP9.2 | NMOS7.1 75.25,39.18 78.42,42.36 PMOS7.2 | PMOS7.2 81.85,44.45 84.39,41.91 R23.1 97.92,52.45 97.92,77.85 105.66,85.6 JP11.9
SW_SIG9
  Bottom 0.61: PMOS6.2 32.45,44.45 34.99,41.91 R20.1 42.16,46.23 42.16,49.02 48.01,54.86 48.01,79.51 56.64,88.14 56.64,102.74 72.01,118.11 97.16,118.11 100.58,121.54 JP11.7 | PMOS6.2 28.38,41.91 NMOS6.1 | JP10.2 13.97,39.75 18.67,44.45 PMOS6.2
SWITCH1
  Bottom 0.61: PS1.4 26.42,143.89 29.46,146.94 R3.1 27.3,152.53 27.3,160.91 23.88,164.34 14.61,164.34 11.43,167.51 JP2.1 | C3.1 7.11,168.28 9.4,170.56 JP2.1 | JP2.1 11.43,175.51 14.73,178.82 PMOS.3
SWITCH2
  Bottom 0.61: PS2.4 67.39,152.4 | C6.1 67.39,152.4 | 67.39,152.4 67.39,163.24 64.01,166.62 JP3.1 64.01,179.32 70.87,186.18 76.07,186.18 77.85,184.4 77.85,182.44 PMOS1.3 86.11,182.37 R6.1
SWITCH3
  Bottom 0.61: R9.1 135.51,180.34 131.7,184.15 PMOS2.3 118.74,184.15 116.2,181.61 JP4.1 116.2,150.24 116.33,150.11 C9.1 116.33,150.62 119.63,147.32 125.56,147.32 PS3.4
SWITCH4
  Bottom 0.61: R18.1 136.53,113.03 PMOS5.3 119.63,113.03 116.2,109.6 JP5.1 116.2,85.09 112.27,81.15 C18.1 112.27,77.09 116.46,72.9 124.65,72.9 PS6.4
SWITCH5
  Bottom 0.61: PS5.4 80.26,66.8 74.3,72.77 66.8,72.77 61.98,77.6 C15.1 61.98,81.28 65.91,85.22 JP6.1 65.91,108.33 70.74,113.16 76.39,113.16 PMOS4.3 86.74,113.03 R15.1
SWITCH6
  Bottom 0.61: PS4.4 24.19,72.77 18.67,72.77 C12.1 12.19,86.99 14.86,89.66 JP7.1 14.86,105.03 20.32,110.49 PMOS3.3 38.73,110.49 R12.1
SWITCH7
  Bottom 0.61: R27.1 137.92,45.72 PMOS8.3 121.92,45.72 116.2,40.01 JP8.1 116.2,26.92 117.6,25.53 117.6,21.72 112.27,16.38 C27.1 112.27,12.32 114.81,9.78 120.2,9.78 PS9.4
SWITCH8
  Bottom 0.61: R24.1 76.64,45.85 PMOS7.3 70.99,45.72 64.01,38.73 JP9.1 64.01,18.29 61.98,16.26 C24.1 61.98,12.57 65.91,8.64 73.15,8.64 76.2,5.59 PS8.4
SWITCH9
  Bottom 0.61: R21.1 26.61,45.85 PMOS6.3 17.02,45.72 11.43,40.13 JP10.1 11.43,28.07 12.19,27.3 C21.1 14.92,14.22 PS7.4